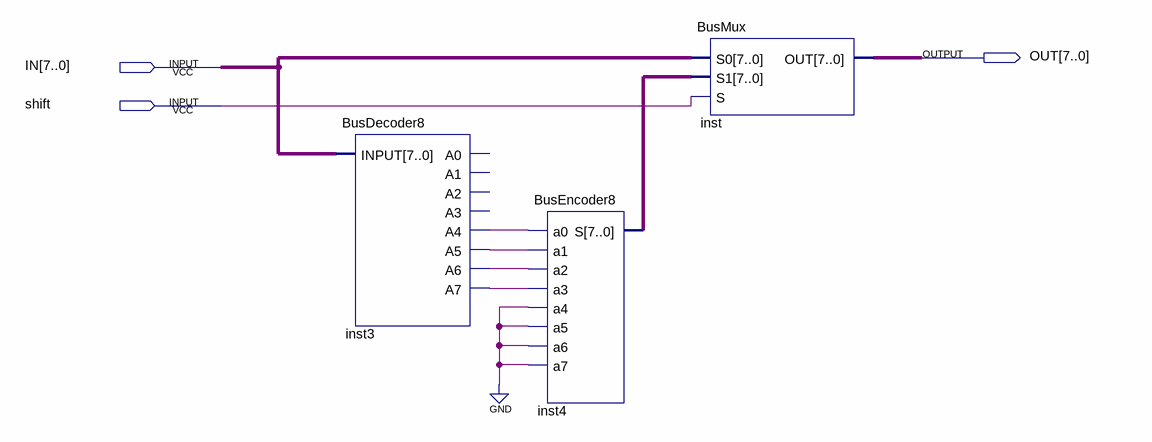
[diagram p0: schematic sheet]
// Quartus schematic Shift4Bit.bdf as structural Verilog: 3 symbols, 3 pins
module Shift4Bit (
  input  [7:0] IN,
  input  shift,
  output [7:0] OUT
);

  wire inst3_a4, inst3_a5, inst3_a6, inst3_a7;
  wire [7:0] inst4_s;

  BusDecoder8 inst3 (.INPUT(IN), .A4(inst3_a4), .A5(inst3_a5), .A6(inst3_a6), .A7(inst3_a7));  // open: A0, A1, A2, A3
  BusEncoder8 inst4 (
    .a0(inst3_a4), .a1(inst3_a5), .a2(inst3_a6), .a3(inst3_a7), .a4(1'b0), .a5(1'b0), .a6(1'b0), .a7(1'b0),
    .S(inst4_s));
  BusMux inst (.S0(IN), .S1(inst4_s), .S(shift), .OUT(OUT));
endmodule
